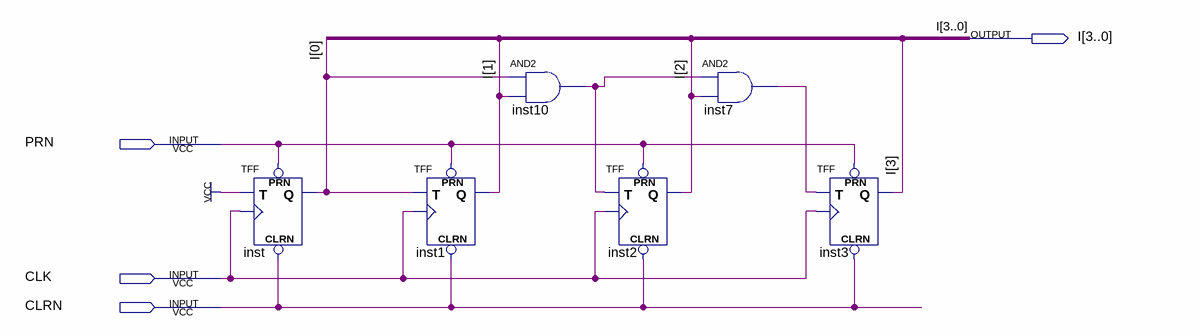
[diagram p0: schematic sheet]
// Quartus schematic RIPPLE_COUNTER.bdf as structural Verilog: 6 symbols, 4 pins
module RIPPLE_COUNTER (
  input  PRN,
  input  CLK,
  input  CLRN,
  output [3:0] I
);

  wire inst7_out, inst10_out;

  TFF inst (.PRN(PRN), .CLRN(CLRN), .T(1'b1), .CLK(CLK), .Q(I[0]));
  TFF inst1 (.PRN(PRN), .CLRN(CLRN), .T(I[0]), .CLK(CLK), .Q(I[1]));
  and inst10 (inst10_out, I[0], I[1]);
  TFF inst2 (.PRN(PRN), .CLRN(CLRN), .T(inst10_out), .CLK(CLK), .Q(I[2]));
  and inst7 (inst7_out, inst10_out, I[2]);
  TFF inst3 (.PRN(PRN), .CLRN(CLRN), .T(inst7_out), .CLK(CLK), .Q(I[3]));
endmodule
